# Altium schematic sheet esp32_c6_a1_power.SchDoc: Power
size A3; SheetNumber: 3; SheetTotal: 4
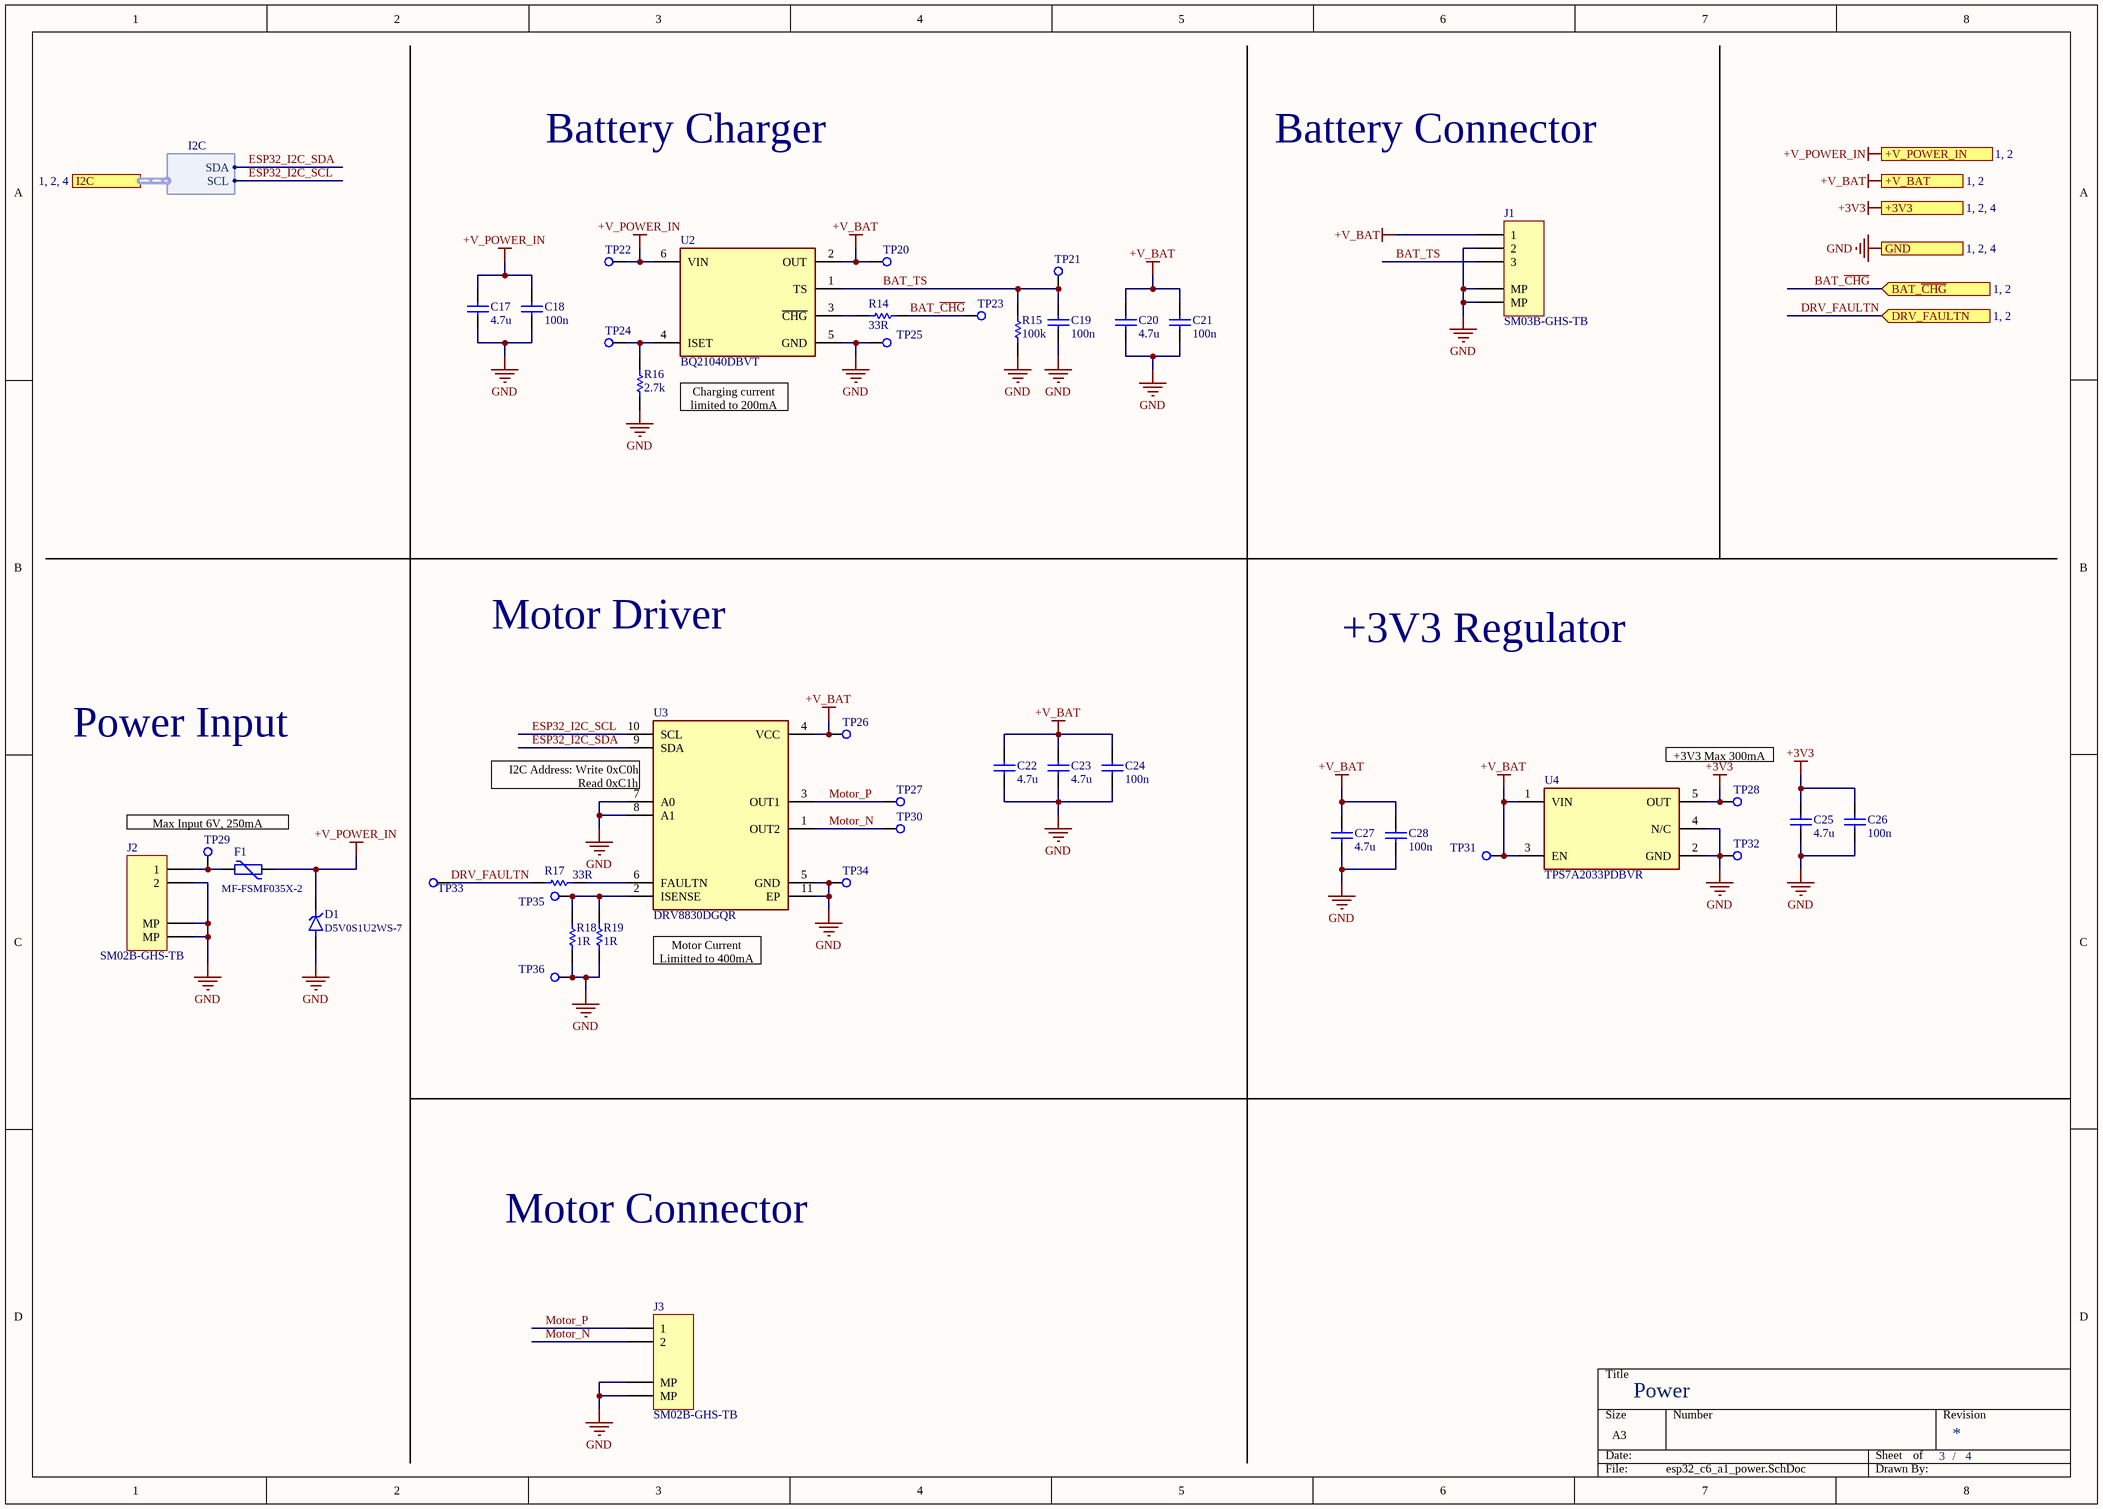
[diagram p0: esp32_c6_a1_power.SchDoc]

## Parts
C17  value 4.7u  [C_0603]  (hidden comment: 0603)
C18  value 100n  [C_0402]  (hidden comment: 0402)
C19  value 100n  [C_0402]  (hidden comment: 0402)
C20  value 4.7u  [C_0603]  (hidden comment: 0603)
C21  value 100n  [C_0402]  (hidden comment: 0402)
C22  value 4.7u  [C_0603]  (hidden comment: 0603)
C23  value 4.7u  [C_0603]  (hidden comment: 0603)
C24  value 100n  [C_0402]  (hidden comment: 0402)
C25  value 4.7u  [C_0603]  (hidden comment: 0603)
C26  value 100n  [C_0402]  (hidden comment: 0402)
C27  value 4.7u  [C_0603]  (hidden comment: 0603)
C28  value 100n  [C_0402]  (hidden comment: 0402)
D1  D5V0S1U2WS-7  [SOD2513X120N]
F1  MF-FSMF035X-2  [0603-F1608X100N]
J1  SM03B-GHS-TB  [jst_sm03b-ghs-tb]
J2  SM02B-GHS-TB  [JST-SM02B-GHS-TB]
J3  SM02B-GHS-TB  [JST-SM02B-GHS-TB]
R14  value 33R  [R_0402]  (hidden comment: 0402)
R15  value 100k  [R_0402]  (hidden comment: 0402)
R16  value 2.7k  [R_0402]  (hidden comment: 0402)
R17  value 33R  [R_0402]  (hidden comment: 0402)
R18  value 1R  [R_0603]  (hidden comment: 0603)
R19  value 1R  [R_0603]  (hidden comment: 0603)
TP20  TP  [tp_round_80]  (value not drawn)  (no BOM)
TP21  TP  [tp_round_80]  (value not drawn)  (no BOM)
TP22  TP  [tp_round_80]  (value not drawn)  (no BOM)
TP23  TP  [tp_round_80]  (value not drawn)  (no BOM)
TP24  TP  [tp_round_80]  (value not drawn)  (no BOM)
TP25  TP  [tp_round_80]  (value not drawn)  (no BOM)
TP26  TP  [tp_round_80]  (value not drawn)  (no BOM)
TP27  TP  [tp_round_80]  (value not drawn)  (no BOM)
TP28  TP  [tp_round_80]  (value not drawn)  (no BOM)
TP29  TP  [tp_round_80]  (value not drawn)  (no BOM)
TP30  TP  [tp_round_80]  (value not drawn)  (no BOM)
TP31  TP  [tp_round_80]  (value not drawn)  (no BOM)
TP32  TP  [tp_round_80]  (value not drawn)  (no BOM)
TP33  TP  [tp_round_80]  (value not drawn)  (no BOM)
TP34  TP  [tp_round_80]  (value not drawn)  (no BOM)
TP35  TP  [tp_round_80]  (value not drawn)  (no BOM)
TP36  TP  [tp_round_80]  (value not drawn)  (no BOM)
U2  BQ21040DBVT  [SOT95P280X110-6N]
U3  DRV8830DGQR  [IC_XTR111AIDGQR]
U4  TPS7A2033PDBVR  [SOT95P280X110-5N]

## Ports
+3V3 (see 1, 2, 4), +V_BAT (see 1, 2), +V_POWER_IN (see 1, 2), BAT_~{CHG} (in, see 1, 2), DRV_FAULTN (in, see 1, 2), GND (see 1, 2, 4), I2C (harness I2C, see 1, 2, 4)

## Harnesses
I2C: SDA, SCL

## Nets
+3V3: C25.2 C26.2 TP28.1 U4.5(OUT) ; port +3V3
+V_BAT: C20.2 C21.2 C22.2 C23.2 C24.2 C27.2 C28.2 J1.1 TP20.1 TP26.1 TP31.1 U2.2(OUT) U3.4(VCC) U4.1(VIN) U4.3(EN) ; port +V_BAT
+V_POWER_IN: C17.2 C18.2 D1.1 F1.1 TP22.1 U2.6(VIN) ; port +V_POWER_IN
GND: C17.1 C18.1 C19.1 C20.1 C21.1 C22.1 C23.1 C24.1 C25.1 C26.1 C27.1 C28.1 D1.2 J1.2 J1.MP1(MP) J1.MP2(MP) J2.2 J2.MP1(MP) J2.MP2(MP) J3.MP1(MP) J3.MP2(MP) R15.2 R16.2 R18.1 R19.1 TP25.1 TP32.1 TP34.1 TP36.1 U2.5(GND) U3.5(GND) U3.7(A0) U3.8(A1) U3.11(EP) U4.2(GND) U4.4(N/C) ; port GND
BAT_~{CHG}: R14.1 TP23.1 ; port BAT_~{CHG}
BAT_TS: C19.2 J1.3 R15.1 TP21.1 U2.1(TS)
DRV_FAULTN: R17.2 TP33.1 ; port DRV_FAULTN
ESP32_I2C_SCL: U3.10(SCL) ; port I2C.SCL
ESP32_I2C_SDA: U3.9(SDA) ; port I2C.SDA
Motor_N: J3.2 TP30.1 U3.1(OUT2)
Motor_P: J3.1 TP27.1 U3.3(OUT1)
NetF1_2: F1.2 J2.1 TP29.1
NetR14_2: R14.2 U2.3(~{CHG})
NetR16_1: R16.1 TP24.1 U2.4(ISET)
NetR17_1: R17.1 U3.6(FAULTN)
NetR18_2: R18.2 R19.2 TP35.1 U3.2(ISENSE)

## Notes on the sheet
- Battery Charger
- Battery Connector
- Charging current limited to 200mA
- Motor Driver
- +3V3 Regulator
- Power Input
- (near U3) I2C Address: Write 0xC0h Read 0xC1h
- +3V3 Max 300mA
- Max Input 6V, 250mA
- Motor Current Limitted to 400mA
- Motor Connector
- /

## Library data of the parts
C17 C20 C22 C23 C25 C27 = C_0603: SMD 0603 Ceramic Chip Capacitor; Manufacturer: Samsung; MPN: CL10A475KP8NNNC; Cad Data: ?; Part Number: ?; List Code: ?
C18 C19 C21 C24 C26 C28 = C_0402: SMD 0402 Ceramic Chip Capacitor; Manufacturer: Samsung; MPN: CL05B104KP5NNNC; Cad Data: ?; Part Number: ?; List Code: ?
D1 = D5V0S1U2WS-7: 16V Clamp 70A (8/20µs) Ipp Tvs Diode Surface Mount SOD-323; Manufacturer: Diodes; MPN: BZV55C4V7-TP; Value: *
F1 = MF-FSMF035X-2: Polymeric PTC Resettable Fuse 6V 350mA Ih Surface Mount 0603 _1608 Metric_, Concave; Manufacturer: Bourns; Package: 0603 Bourns; MPN: MF-FSMF035X-2; Price: None; Value: *
J1 = SM03B-GHS-TB: CONN HEADER SMD 3POS 1.25MM; Manufacturer: JST; MPN: SM03B-GHS-TB
J2 J3 = SM02B-GHS-TB: CONN HEADER SMD 2POS 1.25MM; Manufacturer: JST; MPN: SM02B-GHS-TB
R14 R17 = R_0402: SMD 0402 Rectangular Thick Film Chip Resistor; Manufacturer: Yageo; MPN: RC0402FR-0733RL; Cad Data: ?; Part Number: ?; List Code: ?
R15 = R_0402: SMD 0402 Rectangular Thick Film Chip Resistor; Manufacturer: Yageo; MPN: RC0402FR-0710KL; Cad Data: ?; Part Number: ?; List Code: ?
R16 = R_0402: SMD 0402 Rectangular Thick Film Chip Resistor; Manufacturer: Yageo; MPN: RC0402FR-072K7L; Cad Data: ?; Part Number: ?; List Code: ?
R18 R19 = R_0603: SMD 0603 Rectangular Thick Film Chip Resistor; Manufacturer: Yageo; MPN: RC0603FR-071RL; Cad Data: ?; Part Number: ?
TP20-TP36 = TP: Test Point
U2 = BQ21040DBVT: 1-cell, 0.8-A Li-ion and Li-polymerymer battery charger 6-SOT-23 0 to 125; MF: Texas Instruments; Value: *; SnapEDA_Link: https://www.snapeda.com/parts/BQ21040DBVT/Texas%20Instruments/view-part/1216215/?ref=snap; Texas_Instruments-Purchase-URL: https://snapeda.com/shop?store=Texas+Instruments&id=1216215; Mouser-Purchase-URL: https://snapeda.com/shop?store=Mouser&id=1216215; Digi-Key_Part_Number: 296-44196-1-ND; DigiKey-Purchase-URL: https://snapeda.com/shop?store=DigiKey&id=1216215; Package: SOT-23-6 Texas Instruments; Manufacturer: BQ21040DBVT; MPN: BQ21040DBVT
U3 = DRV8830DGQR: 6.8-V, 1-A H-bridge motor driver with speed regulation and i2c control 10-HVSSOP -40 to 85; Manufacturer: Texas Instruments; Package: HVSSOP-10 Texas Instruments; Check_prices: https://www.snapeda.com/parts/DRV8830DGQR/Texas%20Instruments/view-part/552464/?ref=eda; Price: None; SnapEDA_Link: https://www.snapeda.com/parts/DRV8830DGQR/Texas%20Instruments/view-part/552464/?ref=snap; Value: *; MPN: DRV8830DGQR; Purchase-URL: https://pricing.snapeda.com/search/part/DRV8830DGQR/?ref=eda; Availability: Good
U4 = TPS7A2033PDBVR: Linear Voltage Regulator IC Positive Fixed 1 Output 300mA SOT-23-5; Manufacturer: Texas Instruments; Value: *; MPN: TPS7A2033PDBVR